# EAGLE design A6SS-3 (EAGLE 6.6.0)

## Sheet 1 of 4: SS-read
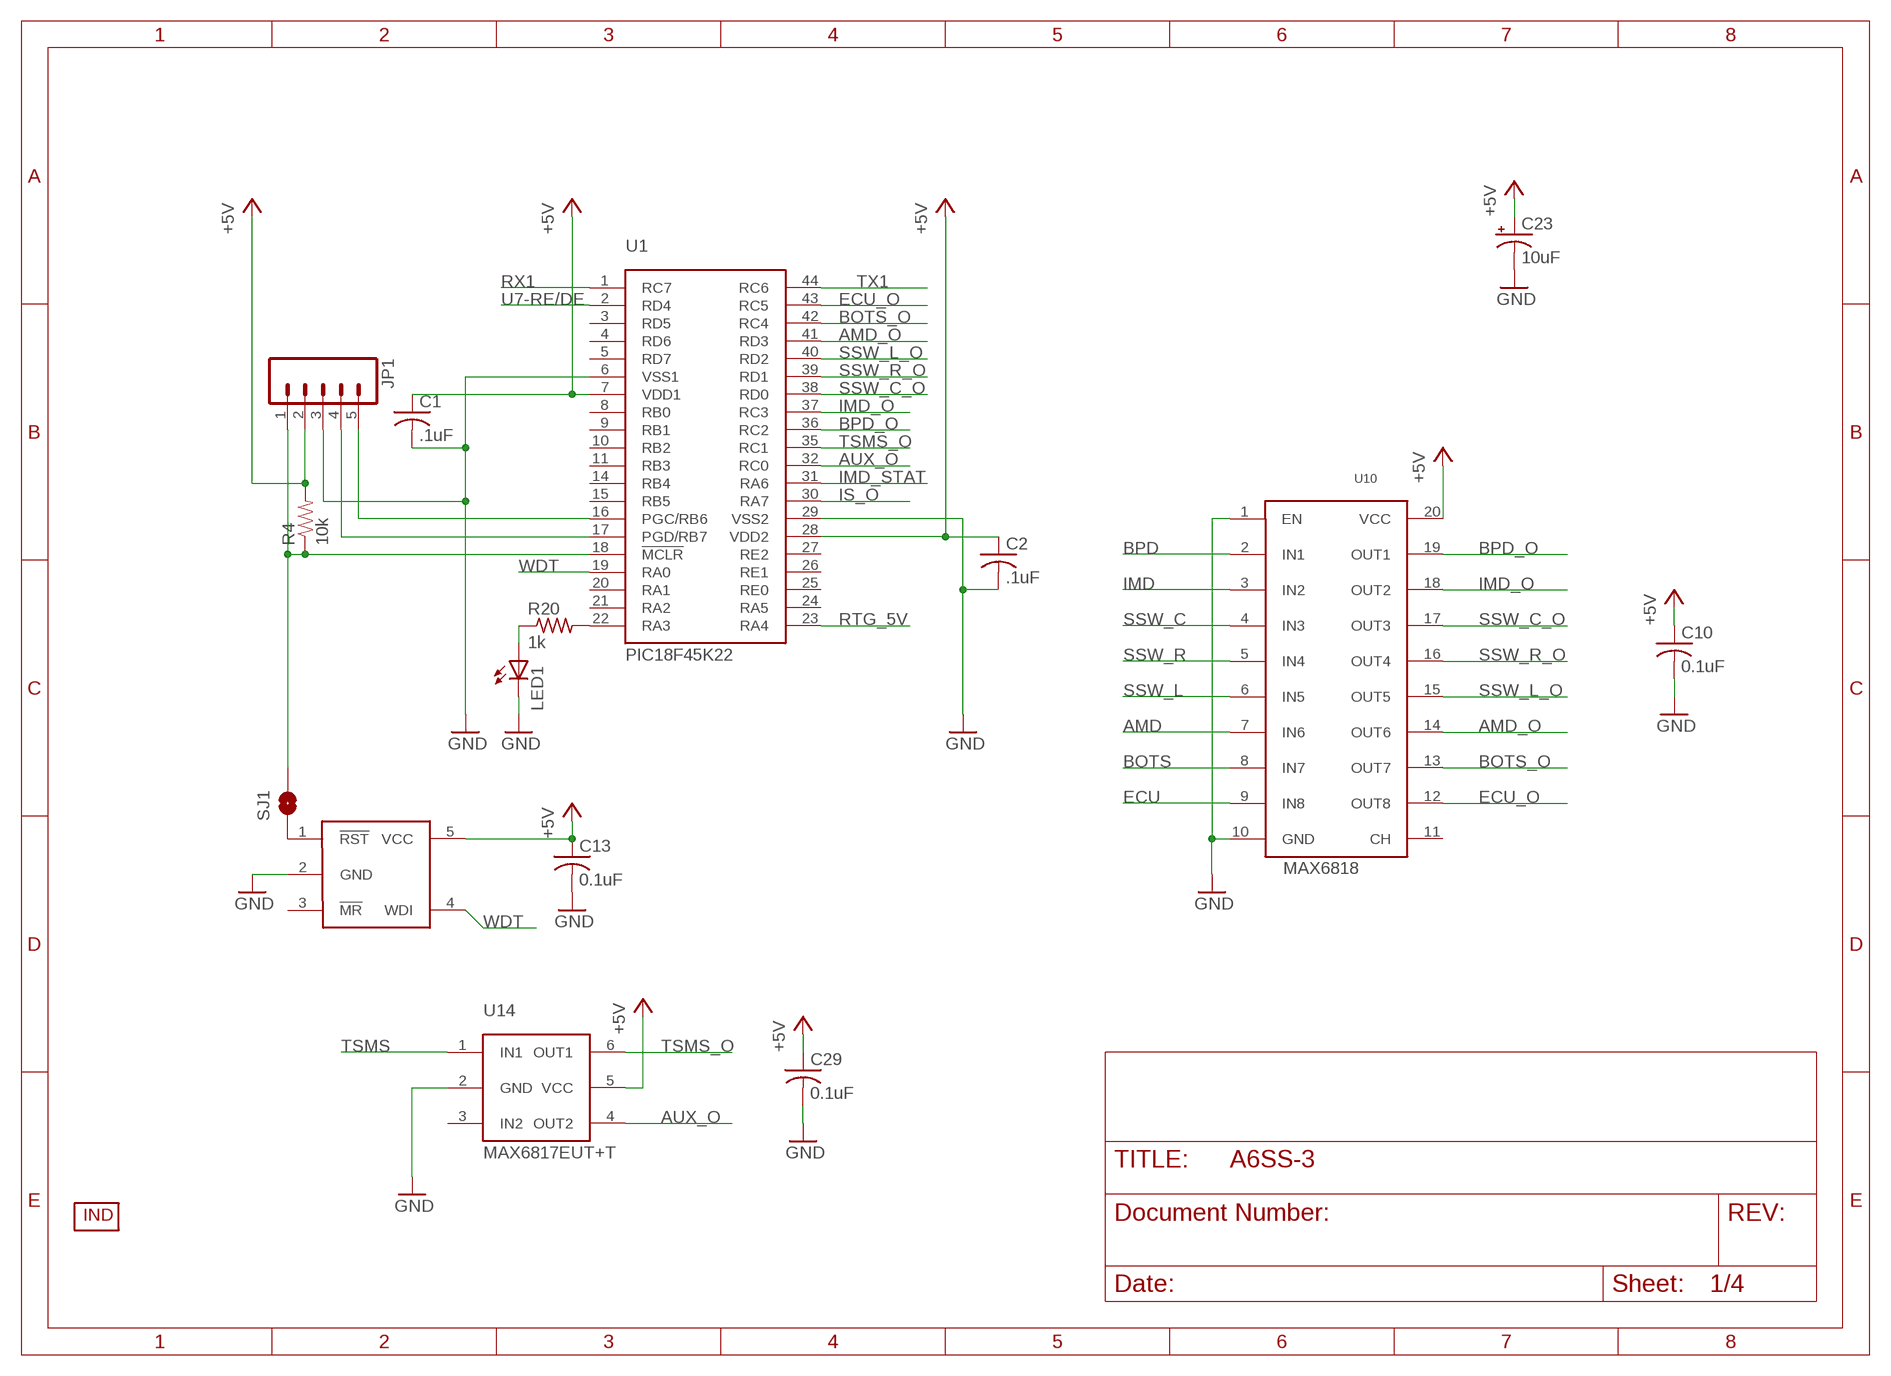
[diagram p0: schematic, sheet 1]

### Parts
C1  .1uF  C-USC0603  [C0603]
C2  .1uF  C-USC0603  [C0603]
C10  0.1uF  C-USC0603  [C0603]
C13  0.1uF  C-USC0603  [C0603]
C23  10uF  10UF-TANT  [EIA3216]
C29  0.1uF  C-USC0603  [C0603]
JP1  M05LOCK_LONGPADS  [1X05_LOCK_LONGPADS]
LED1  LEDCHIPLED_0603  [CHIPLED_0603]
R4  10k  RESISTOR0603-RES  [0603-RES]
R20  1k  R-US_R0603  [R0603]
SJ1  SOLDERJUMPERNO  [SJ_2S-NO]
U1  PIC18F45K22  [TQFP-44]
U10  MAX6818  [SSOP-20]
U14  MAX6817EUT+T  [SOT23-6]
U15  MAX823  [SOT23-5L]
U$1  INDPK1  [PICKIT-PIN-1]

### Nets
+5V: C1.1 C2.1 C10.1 C13.1 C23.A(+) C29.1 JP1.2 R4.2 U1.7(VDD1) U1.28(VDD2) U10.20(VCC) U14.5(VCC) U15.5(VCC) ; also sheet 2,3,4
AMD: U10.7(IN6) ; also sheet 4
AMD_O: U1.41(RD3) U10.14(OUT6)
AUX_O: U1.32(RC0) U14.4(OUT2)
BOTS: U10.8(IN7) ; also sheet 4
BOTS_O: U1.42(RC4) U10.13(OUT7)
BPD: U10.2(IN1) ; also sheet 4
BPD_O: U1.36(RC2) U10.19(OUT1)
ECU: U10.9(IN8) ; also sheet 4
ECU_O: U1.43(RC5) U10.12(OUT8)
GND: C1.2 C2.2 C10.2 C13.2 C23.C(-) C29.2 JP1.3 LED1.C U1.6(VSS1) U1.29(VSS2) U10.1(EN) U10.10(GND) U14.2(GND) U15.2(GND) ; also sheet 2,3,4
IMD: U10.3(IN2) ; also sheet 4
IMD_O: U1.37(RC3) U10.18(OUT2)
IMD_STAT: U1.31(RA6) ; also sheet 3
IS_O: U1.30(RA7) ; also sheet 4
N$1: SJ1.1 U15.1(!RST)
N$16: LED1.A R20.1
N$20: R20.2 U1.22(RA3)
N$40: JP1.4 U1.17(PGD/RB7)
N$43: JP1.5 U1.16(PGC/RB6)
N$46: JP1.1 R4.1 SJ1.2 U1.18(!MCLR)
RTG_5V: U1.23(RA4) ; also sheet 2
RX1: U1.1(RC7) ; also sheet 4
SSW_C: U10.4(IN3) ; also sheet 4
SSW_C_O: U1.38(RD0) U10.17(OUT3)
SSW_L: U10.6(IN5) ; also sheet 4
SSW_L_O: U1.40(RD2) U10.15(OUT5)
SSW_R: U10.5(IN4) ; also sheet 4
SSW_R_O: U1.39(RD1) U10.16(OUT4)
TSMS: U14.1(IN1) ; also sheet 4
TSMS_O: U1.35(RC1) U14.6(OUT1)
TX1: U1.44(RC6) ; also sheet 4
U7-RE/DE: U1.2(RD4) ; also sheet 4
WDT: U1.19(RA0) U15.4(WDI)
Unconnected: U1.3(RD5) U1.4(RD6) U1.5(RD7) U1.8(RB0) U1.9(RB1) U1.10(RB2) U1.11(RB3) U1.14(RB4) U1.15(RB5) U1.20(RA1) U1.21(RA2) U1.24(RA5) U1.25(RE0) U1.26(RE1) U1.27(RE2) U10.11(CH) U14.3(IN2) U15.3(!MR)

## Sheet 2 of 4: PRE charge
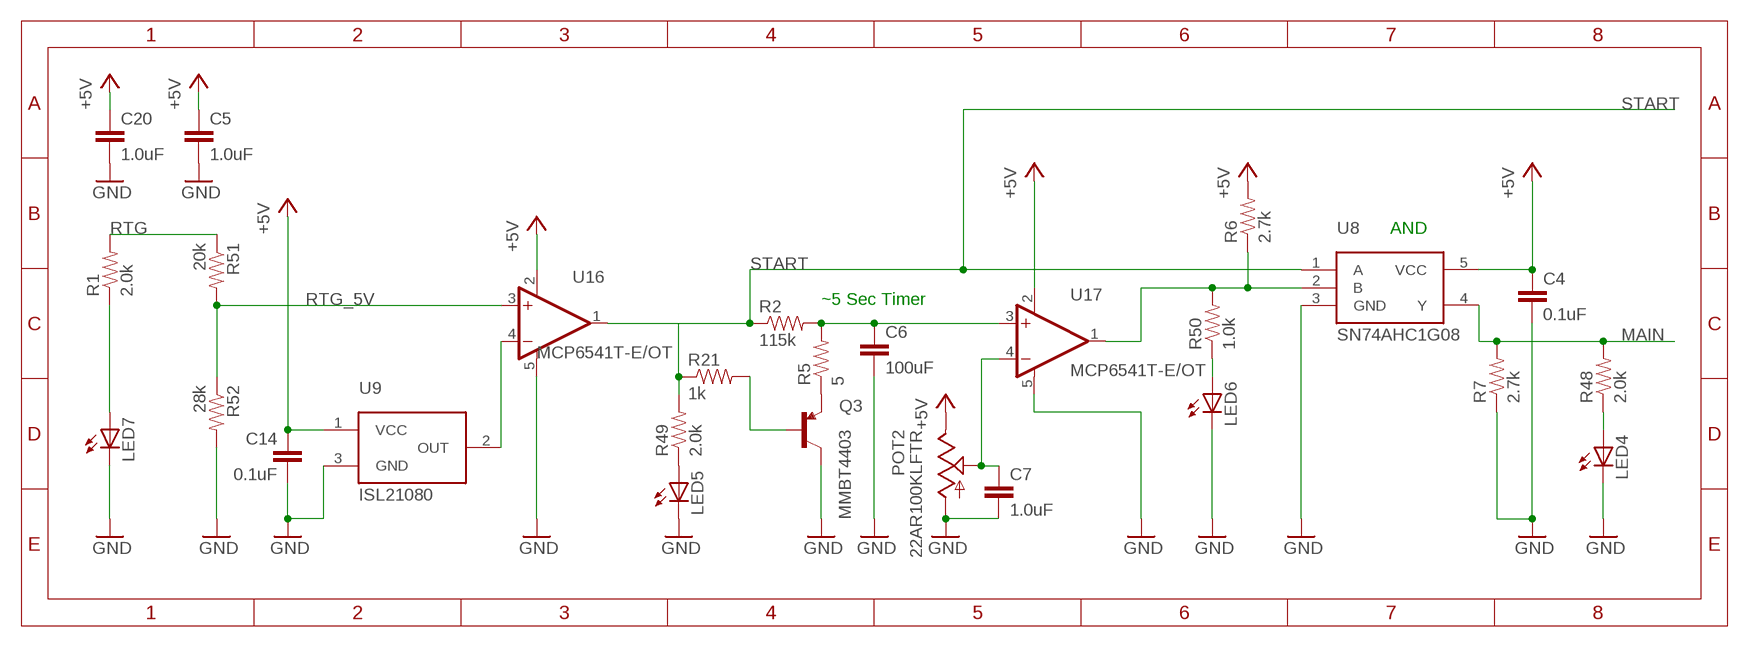
[diagram p1: schematic, sheet 2]

### Parts
C4  0.1uF  CAP0603-CAP  [0603-CAP]
C5  1.0uF  CAP0603-CAP  [0603-CAP]
C6  100uF  CAP1206  [1206]
C7  1.0uF  CAP0805  [0805]
C14  0.1uF  CAP0603-CAP  [0603-CAP]
C20  1.0uF  CAP0805  [0805]
LED4  LEDCHIPLED_0603  [CHIPLED_0603]
LED5  LEDCHIPLED_0603  [CHIPLED_0603]
LED6  LEDCHIPLED_0603  [CHIPLED_0603]
LED7  LEDCHIPLED_0603  [CHIPLED_0603]
POT2  22AR100KLFTR  [22AR100KLFTR]
Q3  MMBT4403  TRANSISTOR_PNPMMBT4403  [SOT23]
R1  2.0k  RESISTOR0603-RES  [0603-RES]
R2  115k  RESISTOR1206  [1206]
R5  5  RESISTOR0603-RES  [0603-RES]
R6  2.7k  RESISTOR0603-RES  [0603-RES]
R7  2.7k  RESISTOR0603-RES  [0603-RES]
R21  1k  RESISTOR0603-RES  [0603-RES]
R48  2.0k  RESISTOR0603-RES  [0603-RES]
R49  2.0k  RESISTOR0603-RES  [0603-RES]
R50  1.0k  RESISTOR0603-RES  [0603-RES]
R51  20k  RESISTOR0603-RES  [0603-RES]
R52  28k  RESISTOR0603-RES  [0603-RES]
U8  SN74AHC1G08  NC7SZ08P5X  [SOT23-5]
U9  ISL21080  [SOT-23]
U16  MCP6541T-E/OT  OPA344  [SOT23-5]
U17  MCP6541T-E/OT  OPA344  [SOT23-5]

### Nets
+5V: C4.1 C5.1 C14.1 C20.1 POT2.1(CCW) R6.2 U8.5(VCC) U9.1(VCC) U16.2(V-) U17.2(V-) ; also sheet 1,3,4
GND: C4.2 C5.2 C6.2 C7.2 C14.2 C20.2 LED4.C LED5.C LED6.C LED7.C POT2.3(CW) Q3.3(C) R7.1 R52.2 U8.3(GND) U9.3(GND) U16.5(V+) U17.5(V+) ; also sheet 1,3,4
MAIN: R7.2 R48.2 U8.4(Y) ; also sheet 4
N$3: C7.1 POT2.2(W) U17.4(-IN)
N$5: Q3.1(B) R21.2
N$6: Q3.2(E) R5.1
N$11: U9.2(OUT) U16.4(-IN)
N$33: LED7.A R1.1
N$59: C6.1 R2.2 R5.2 U17.3(+IN)
N$62: R6.1 R50.2 U8.2(B) U17.1(OUT)
N$63: LED4.A R48.1
N$65: LED5.A R49.1
N$67: LED6.A R50.1
RTG: R1.2 R51.1 ; also sheet 4
RTG_5V: R51.2 R52.1 U16.3(+IN) ; also sheet 1
START: R2.1 R21.1 R49.2 U8.1(A) U16.1(OUT) ; also sheet 4

### Notes on the sheet
- AND
- ~5 Sec Timer

## Sheet 3 of 4
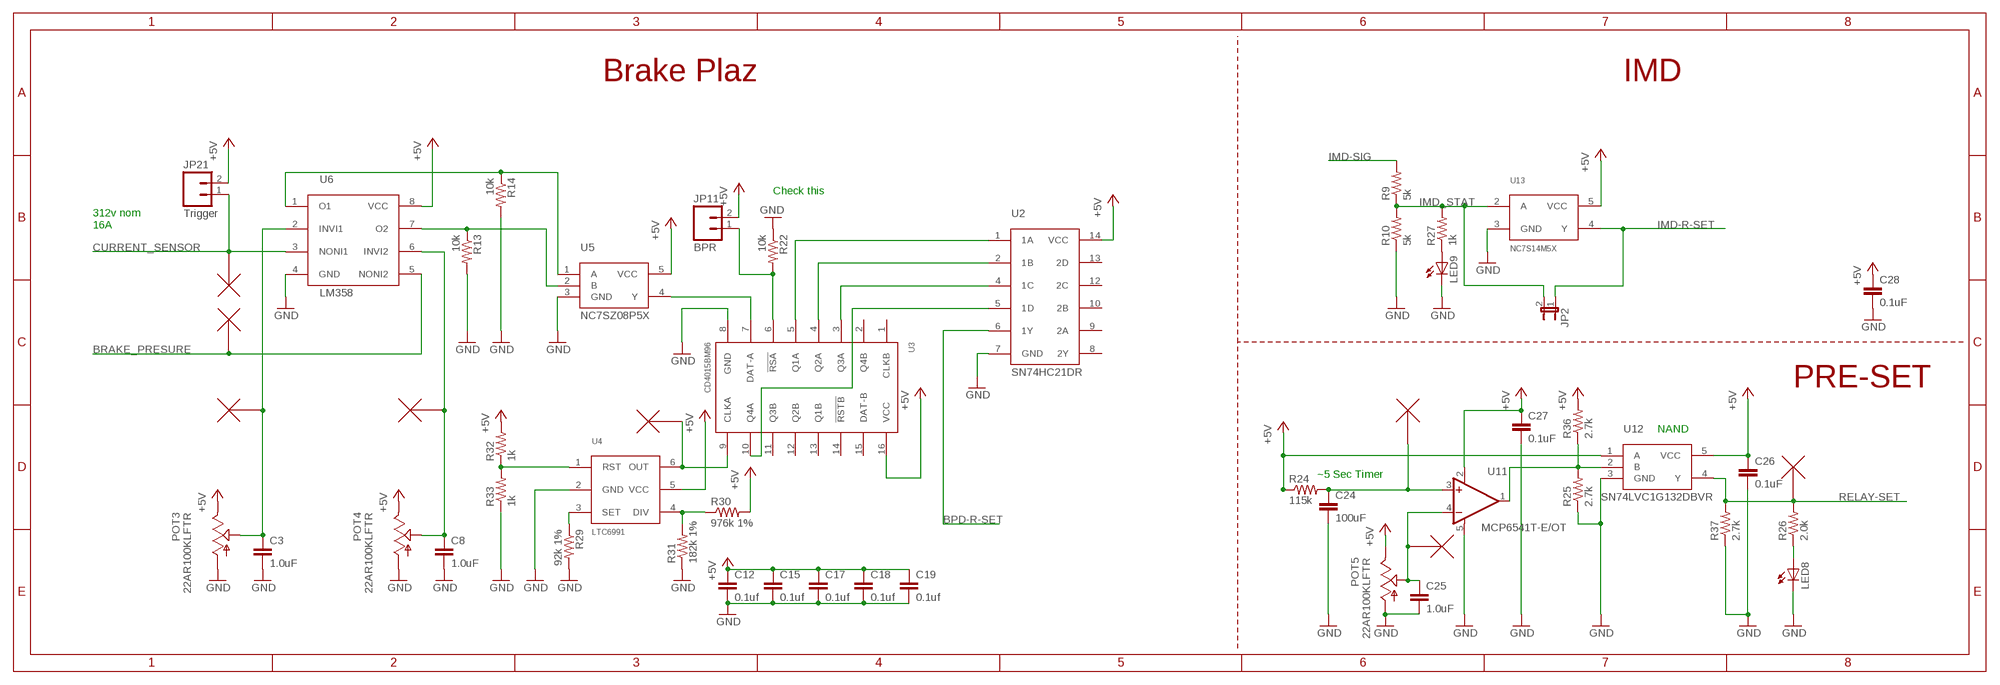
[diagram p2: schematic, sheet 3]

### Parts
BPR  TESTPOINT  [R0603]
C3  1.0uF  1.0UF-25V-+80/-20(0805)  [0805]
C8  1.0uF  1.0UF-25V-+80/-20(0805)  [0805]
C12  0.1uf  CAP0603-CAP  [0603-CAP]
C15  0.1uf  CAP0603-CAP  [0603-CAP]
C17  0.1uf  CAP0603-CAP  [0603-CAP]
C18  0.1uf  CAP0603-CAP  [0603-CAP]
C19  0.1uf  CAP0805  [0805]
C24  100uF  CAP1206  [1206]
C25  1.0uF  CAP0805  [0805]
C26  0.1uF  CAP0603-CAP  [0603-CAP]
C27  0.1uF  CAP0603-CAP  [0603-CAP]
C28  0.1uF  CAP0805  [0805]
CLK  TESTPOINT  [R0603]
CS  TESTPOINT  [R0603]
CST  TESTPOINT  [R0603]
JP2  JUMPER-2SMD-NO  [SJ_2S-NO]
JP11  BPR  M02POLAR_LOCK  [MOLEX-1X2_LOCK]
JP21  Trigger  M02POLAR_LOCK  [MOLEX-1X2_LOCK]
LED8  LEDCHIPLED_0603  [CHIPLED_0603]
LED9  LEDCHIPLED_0603  [CHIPLED_0603]
PCG  TESTPOINT  [R0603]
POT3  22AR100KLFTR  [22AR100KLFTR]
POT4  22AR100KLFTR  [22AR100KLFTR]
POT5  22AR100KLFTR  [22AR100KLFTR]
R9  5k  RESISTOR0603-RES  [0603-RES]
R10  5k  RESISTOR0603-RES  [0603-RES]
R13  10k  RESISTOR0603-RES  [0603-RES]
R14  10k  RESISTOR0603-RES  [0603-RES]
R22  10k  RESISTOR0603-RES  [0603-RES]
R24  115k  RESISTOR1206  [1206]
R25  2.7k  RESISTOR0603-RES  [0603-RES]
R26  2.0k  RESISTOR0603-RES  [0603-RES]
R27  1k  RESISTOR0603-RES  [0603-RES]
R29  92k 1%  RESISTOR0603-RES  [0603-RES]
R30  976k 1%  RESISTOR0603-RES  [0603-RES]
R31  182k 1%  RESISTOR0603-RES  [0603-RES]
R32  1k  RESISTOR0603-RES  [0603-RES]
R33  1k  RESISTOR0603-RES  [0603-RES]
R36  2.7k  RESISTOR0603-RES  [0603-RES]
R37  2.7k  RESISTOR0603-RES  [0603-RES]
RST  TESTPOINT  [R0603]
U2  SN74HC21DR  SN74HC20DR  [SO14]
U3  CD4015BM96  [SO-16]
U4  LTC6991  [TSOT-23-6]
U5  NC7SZ08P5X  [SOT23-5]
U6  LM358  [TSSOP-8]
U11  MCP6541T-E/OT  OPA344  [SOT23-5]
U12  SN74LVC1G132DBVR  NC7SZ08P5X  [SOT23-5]
U13  NC7S14M5X  [SOT23-5]
U$2  TESTPOINT  [R0603]
U$3  TESTPOINT  [R0603]

### Nets
+5V: C12.1 C15.1 C17.1 C18.1 C19.1 C26.1 C27.1 C28.1 JP11.2 JP21.2 POT3.1(CCW) POT4.1(CCW) POT5.1(CCW) R24.1 R30.2 R32.2 R36.2 U2.14(VCC) U3.16(VCC) U4.5(VCC) U5.5(VCC) U6.8(VCC) U11.2(V-) U12.1(A) U12.5(VCC) U13.5(VCC) ; also sheet 1,2,4
BPD-R-SET: U2.6(1Y) ; also sheet 4
BRAKE_PRESURE: BPR.1 BPR.2 U6.5(NONI2) ; also sheet 4
CURRENT_SENSOR: CS.1 CS.2 JP21.1 U6.3(NONI1) ; also sheet 4
GND: C3.2 C8.2 C12.2 C15.2 C17.2 C18.2 C19.2 C24.2 C25.2 C26.2 C27.2 C28.2 LED8.C LED9.C POT3.3(CW) POT4.3(CW) POT5.3(CW) R10.1 R13.2 R14.2 R22.1 R25.1 R29.2 R31.1 R33.1 R37.1 U2.7(GND) U3.8(GND) U4.2(GND) U5.3(GND) U6.4(GND) U11.5(V+) U12.3(GND) U13.3(GND) ; also sheet 1,2,4
IMD-R-SET: JP2.1 U13.4(Y) ; also sheet 4
IMD-SIG: R9.2 ; also sheet 4
IMD_STAT: JP2.2 R9.1 R10.2 R27.2 U13.2(A) ; also sheet 1
N$4: C25.1 POT5.2(W) RST.1 RST.2 U11.4(-IN)
N$7: U2.5(1D) U3.10(Q4A)
N$10: R30.1 R31.2 U4.4(DIV)
N$13: U3.7(DAT-A) U5.4(Y)
N$14: JP11.1 R22.2 U3.6(!RSA)
N$15: C24.1 R24.2 U11.3(+IN) U$2.1 U$2.2
N$17: U2.1(1A) U3.5(Q1A)
N$18: U2.2(1B) U3.4(Q2A)
N$19: U2.4(1C) U3.3(Q3A)
N$21: R29.1 U4.3(SET)
N$22: CLK.1 CLK.2 U3.9(CLKA) U4.6(OUT)
N$23: C8.1 PCG.1 PCG.2 POT4.2(W) U6.6(INVI2)
N$24: R25.2 R36.1 U11.1(OUT) U12.2(B)
N$25: R32.1 R33.2 U4.1(RST)
N$26: C3.1 CST.1 CST.2 POT3.2(W) U6.2(INVI1)
N$28: R14.1 U5.1(A) U6.1(O1)
N$29: LED8.A R26.1
N$30: R13.1 U5.2(B) U6.7(O2)
N$32: LED9.A R27.1
RELAY-SET: R26.2 R37.2 U12.4(Y) U$3.1 U$3.2 ; also sheet 4
Unconnected: U2.8(2Y) U2.9(2A) U2.10(2B) U2.12(2C) U2.13(2D) U3.1(CLKB) U3.2(Q4B) U3.11(Q3B) U3.12(Q2B) U3.13(Q1B) U3.14(!RSTB) U3.15(DAT-B)

### Notes on the sheet
- Brake Plaz | IMD
- Check this
- 312v nom
  16A
- PRE-SET
- NAND
- ~5 Sec Timer

## Sheet 4 of 4
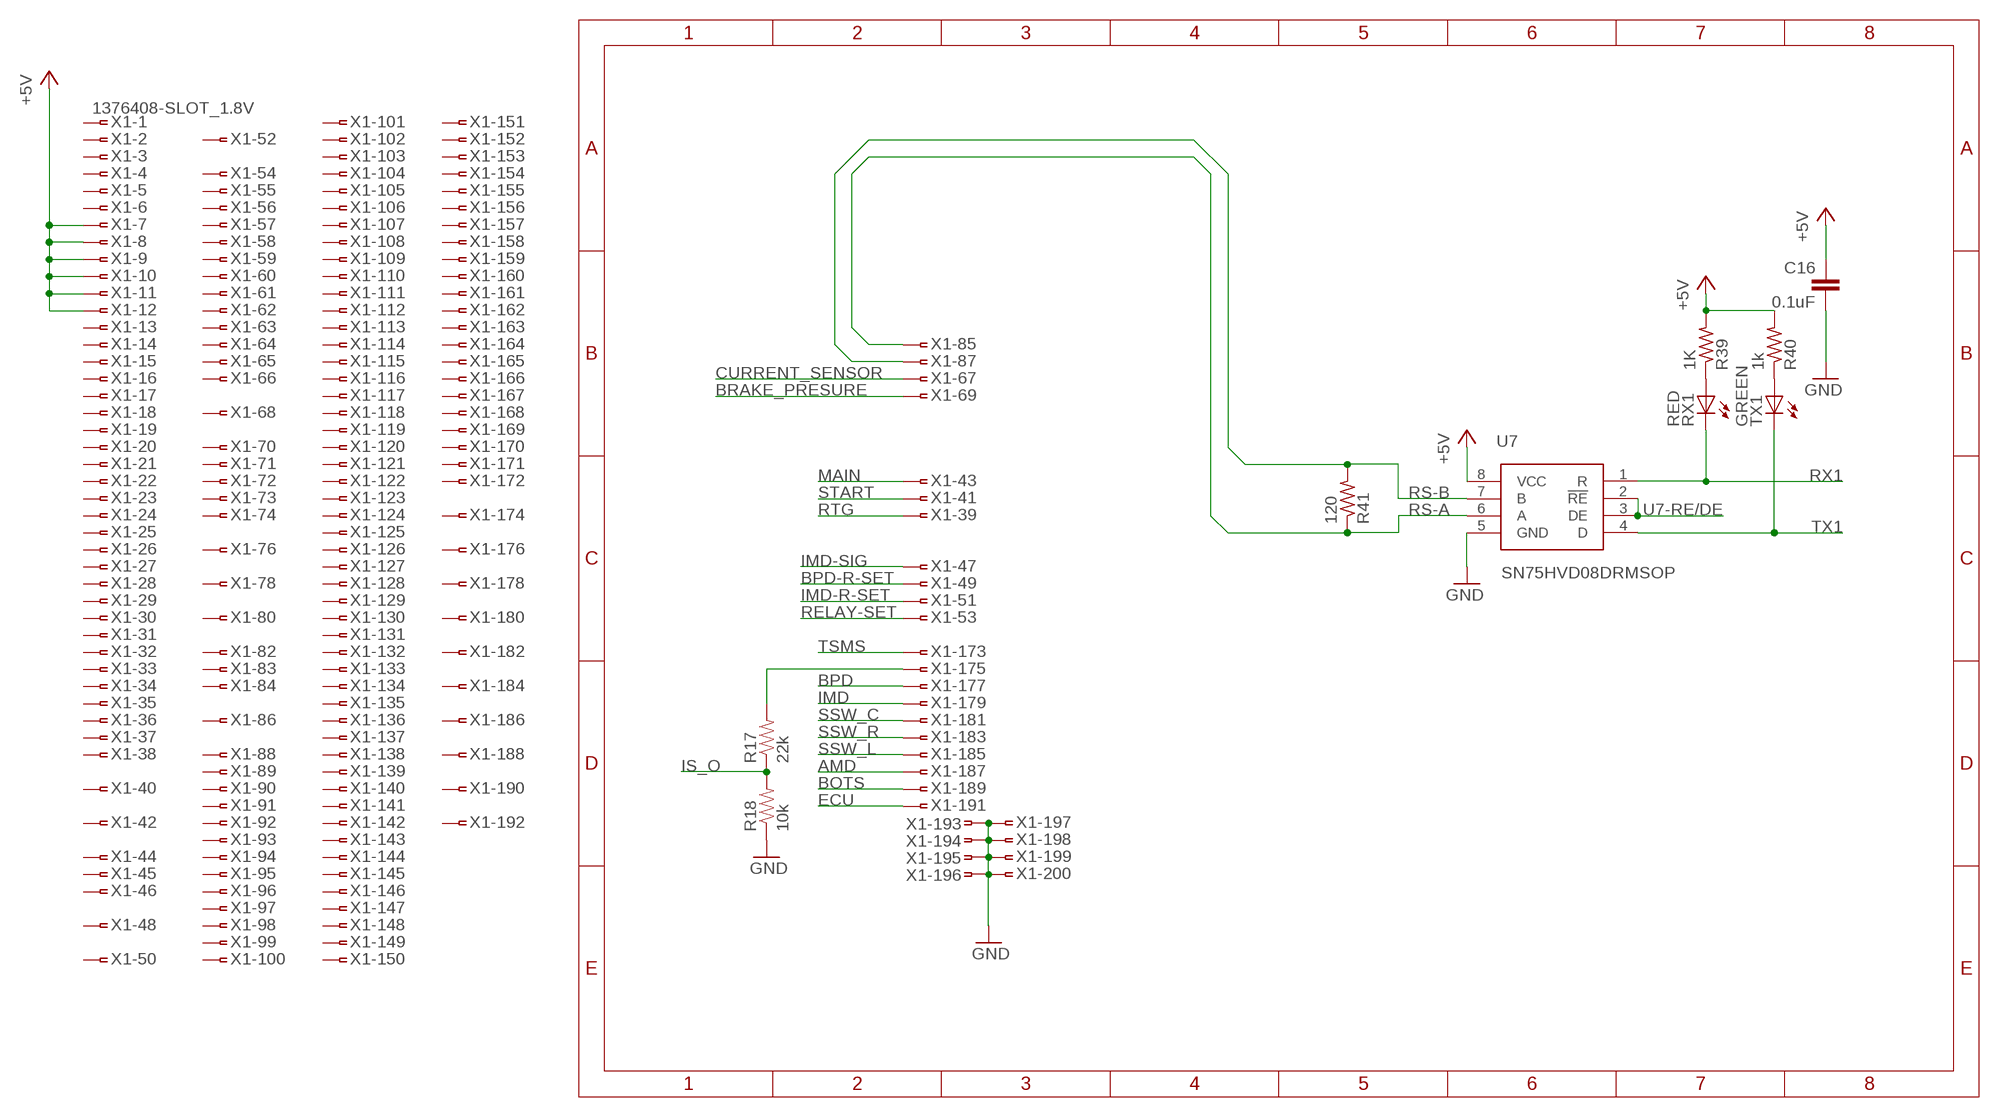
[diagram p3: schematic, sheet 4]

### Parts
C16  0.1uF  CAP0603-CAP  [0603-CAP]
R17  22k  RESISTOR0805-RES  [0805]
R18  10k  RESISTOR0805-RES  [0805]
R39  1K  R-US_R0603  [R0603]
R40  1k  R-US_R0603  [R0603]
R41  120  R-US_R0603  [R0603]
RX1  RED  LEDCHIPLED_0603  [CHIPLED_0603]
TX1  GREEN  LEDCHIPLED_0603  [CHIPLED_0603]
U7  SN75HVD08DRMSOP  [MSOP-8]
X1  1376408-SLOT_1.8V  [SLOT-1376408-1_1.8V]

### Nets
+5V: C16.1 R39.2 R40.2 U7.8(VCC) X1.7 X1.8 X1.9 X1.10 X1.11 X1.12 ; also sheet 1,2,3
AMD: X1.187 ; also sheet 1
BOTS: X1.189 ; also sheet 1
BPD: X1.177 ; also sheet 1
BPD-R-SET: X1.49 ; also sheet 3
BRAKE_PRESURE: X1.69 ; also sheet 3
CURRENT_SENSOR: X1.67 ; also sheet 3
ECU: X1.191 ; also sheet 1
GND: C16.2 R18.1 U7.5(GND) X1.193 X1.194 X1.195 X1.196 X1.197 X1.198 X1.199 X1.200 ; also sheet 1,2,3
IMD: X1.179 ; also sheet 1
IMD-R-SET: X1.51 ; also sheet 3
IMD-SIG: X1.47 ; also sheet 3
IS_O: R17.1 R18.2 ; also sheet 1
MAIN: X1.43 ; also sheet 2
N$2: R17.2 X1.175
N$39: R40.1 TX1.A
N$41: R39.1 RX1.A
RELAY-SET: X1.53 ; also sheet 3
RS-A: R41.1 U7.6(A) X1.85
RS-B: R41.2 U7.7(B) X1.87
RTG: X1.39 ; also sheet 2
RX1: RX1.C U7.1(R) ; also sheet 1
SSW_C: X1.181 ; also sheet 1
SSW_L: X1.185 ; also sheet 1
SSW_R: X1.183 ; also sheet 1
START: X1.41 ; also sheet 2
TSMS: X1.173 ; also sheet 1
TX1: TX1.C U7.4(D) ; also sheet 1
U7-RE/DE: U7.2(!RE) U7.3(DE) ; also sheet 1
Unconnected: X1.1 X1.2 X1.3 X1.4 X1.5 X1.6 X1.13 X1.14 X1.15 X1.16 X1.17 X1.18 X1.19 X1.20 X1.21 X1.22 X1.23 X1.24 X1.25 X1.26 X1.27 X1.28 X1.29 X1.30 X1.31 X1.32 X1.33 X1.34 X1.35 X1.36 X1.37 X1.38 X1.40 X1.42 X1.44 X1.45 X1.46 X1.48 X1.50 X1.52 X1.54 X1.55 X1.56 X1.57 X1.58 X1.59 X1.60 X1.61 X1.62 X1.63 X1.64 X1.65 X1.66 X1.68 X1.70 X1.71 X1.72 X1.73 X1.74 X1.75 X1.76 X1.77 X1.78 X1.79 X1.80 X1.81 X1.82 X1.83 X1.84 X1.86 X1.88 X1.89 X1.90 X1.91 X1.92 X1.93 X1.94 X1.95 X1.96 X1.97 X1.98 X1.99 X1.100 X1.101 X1.102 X1.103 X1.104 X1.105 X1.106 X1.107 X1.108 X1.109 X1.110 X1.111 X1.112 X1.113 X1.114 X1.115 X1.116 X1.117 X1.118 X1.119 X1.120 X1.121 X1.122 X1.123 X1.124 X1.125 X1.126 X1.127 X1.128 X1.129 X1.130 X1.131 X1.132 X1.133 X1.134 X1.135 X1.136 X1.137 X1.138 X1.139 X1.140 X1.141 X1.142 X1.143 X1.144 X1.145 X1.146 X1.147 X1.148 X1.149 X1.150 X1.151 X1.152 X1.153 X1.154 X1.155 X1.156 X1.157 X1.158 X1.159 X1.160 X1.161 X1.162 X1.163 X1.164 X1.165 X1.166 X1.167 X1.168 X1.169 X1.170 X1.171 X1.172 X1.174 X1.176 X1.178 X1.180 X1.182 X1.184 X1.186 X1.188 X1.190 X1.192

## Library data of the parts
BPR CLK CS CST PCG RST U$2 U$3 = DFT2:TESTPOINT
C1 C2 C10 C13 C29 = adafruit:C-US: CAPACITOR, American symbol
C3 C8 = SparkFun-Capacitors:1.0UF-25V-+80/-20(0805); PROD_ID: CAP-11625
C4 C5 C7 C12 C14-C20 C25-C28 = SparkFun-Passives:CAP: Capacitor Standard 0603 ceramic capacitor, and 0.1" leaded capacitor.
C6 C24 = SparkFun-Capacitors:CAP: Capacitor Standard 0603 ceramic capacitor, and 0.1" leaded capacitor.
C23 = SparkFun-Capacitors:10UF-TANT: 10uF Tantalum SMT CAP-00811- 16V 10% (EIA-3216); PROD_ID: CAP-00811
JP1 = SparkFun-Connectors:M05: Header 5 Standard 5-pin 0.1" header. Use with straight break away headers (SKU : PRT-00116), right angle break away headers (PRT-00553), swiss pins (PRT-00743), machine pins (PRT-00117), and female headers (PRT-00115). Molex polarized connector foot print use with SKU : PRT-08230 with associated crimp pins and housings.
JP2 = SparkFun-Passives:JUMPER-2: Jumper Basic 0.1" spaced jumper. Use with breakaway headers.
JP11 JP21 = SparkFun-Connectors:M02: Standard 2-pin 0.1" header. Use with - straight break away headers ( PRT-00116) - right angle break away headers (PRT-00553) - swiss pins (PRT-00743) - machine pins (PRT-00117) - female headers (PRT-00115) Molex polarized connector foot print use with: PRT-08233 with associated crimp pins and housings. 2.54_SCREWTERM for use with PRT-10571. 3.5mm Screw Terminal footprints for PRT-08084 5mm Screw Terminal footprints for use with PRT-08433
LED1 LED4-LED9 RX1 TX1 = adafruit:LED: LED OSRAM: - CHIPLED LG R971, LG N971, LY N971, LG Q971, LY Q971, LO R971, LY R971 LH N974, LH R974 LS Q976, LO Q976, LY Q976 LO Q996 - Hyper CHIPLED LW Q18S LB Q993, LB Q99A, LB R99A - SideLED LS A670, LO A670, LY A670, LG A670, LP A670 LB A673, LV A673, LT A673, LW A673 LH A674 LY A675 LS A676, LA A676, LO A676, LY A676, LW A676 LS A679, LY A679, LG A679 - Hyper Micro SIDELED® LS Y876, LA Y876, LO Y876, LY Y876 LT Y87S - SmartLED LW L88C, LW L88S LB L89C, LB L89S, LG L890 LS L89K, LO L89K, LY L89K LS L896, LA L896, LO L896, LY L896 - TOPLED LS T670, LO T670, LY T670, LG T670, LP T670 LSG T670, LSP T670, LSY T670, LOP T670, LYG T670 LG T671, LOG T671, LSG T671 LB T673, LV T673, LT T673, LW T673 LH T674 LS T676, LA T676, LO T676, LY T676, LB T676, LH T676, LSB T676, LW T676 LB T67C, LV T67C, LT T67C, LS T67K, LO T67K, LY T67K, LW E67C LS E67B, LA E67B, LO E67B, LY E67B, LB E67C, LV E67C, LT E67C LW T67C LS T679, LY T679, LG T679 LS T770, LO T770, LY T770, LG T770, LP T770 LB T773, LV T773, LT T773, LW T773 LH T774 LS E675, LA E675, LY E675, LS T675 LS T776, LA T776, LO T776, LY T776, LB T776 LHGB T686 LT T68C, LB T68C - Hyper Mini TOPLED® LB M676 - Mini TOPLED Santana® LG M470 LS M47K, LO M47K, LY M47K Source: http://www.osram.convergy.de/
POT2-POT5 = FSAE Eletric:22AR100KLFTR; PARTNO: 22AR100KLFTR
Q3 = SparkFun-DiscreteSemi:TRANSISTOR_PNP: Generic PNP BJT Double check pinouts against datasheets- not all devices are the same! MMBT3906 - 40V 200mA SOT-23 (TRANS-08052) MMBT4403 - 40V 600mA SOT-23 (TRANS-09245); PROD_ID: TRANS-09245
R1 R4-R7 R9 R10 R17 R18 R21 R25-R27 R36 R37 R48-R50 = SparkFun-Passives:RESISTOR: Resistor Basic schematic elements and footprints for 0603, 1206, and PTH resistors.
R2 R13 R14 R22 R24 R29-R33 R51 R52 = SparkFun-Resistors:RESISTOR: Resistor Basic schematic elements and footprints for 0603, 1206, and PTH resistors.
R20 R39-R41 = adafruit:R-US_: RESISTOR, American symbol
SJ1 = SparkFun-Passives:SOLDERJUMPER: Solder Jumper Standard SMD solder jumper. Used to automate production. Two varients : Normally Open and Normally Closed are the same, but have different paste layers. NC will have a large amount of paste and should jumper during reflow.
U1 = FSAE Eletric:PIC18F45K22
U2 = NASA_LIB:SN74HC20DR
U3 = FSAE Eletric:CD4015BM96
U4 = FSAE Eletric:LTC6991
U5 U8 U12 = FSAE Eletric:NC7SZ08P5X
U6 = NASA_LIB:LM358
U7 = FSAE Eletric:SN75HVD08DR
U9 = DFT2:ISL21080
U10 = NASA_LIB:MAX6818
U11 U16 U17 = SparkFun-AnalogIC:OPA344: Single gate rail-to-rail output op-amp. Inputs extend 300mV past rails.
U13 = FSAE Eletric:NC7S14M5X
U14 = NASA_LIB:MAX6817EUT+T
U15 = NASA_LIB:MAX823
U$1 = FSAE Eletric (2):IND
X1 = con-amp:1376408: DDR1 & DDR2 SODIMM SOCKET 0.6mm Pitch 200 Pos. Standard Profile, Standard Type (used on Kontron X-Board) Source: http://catalog.tycoelectronics.com .. JPN_CD_1376408_S.pdf

## Board
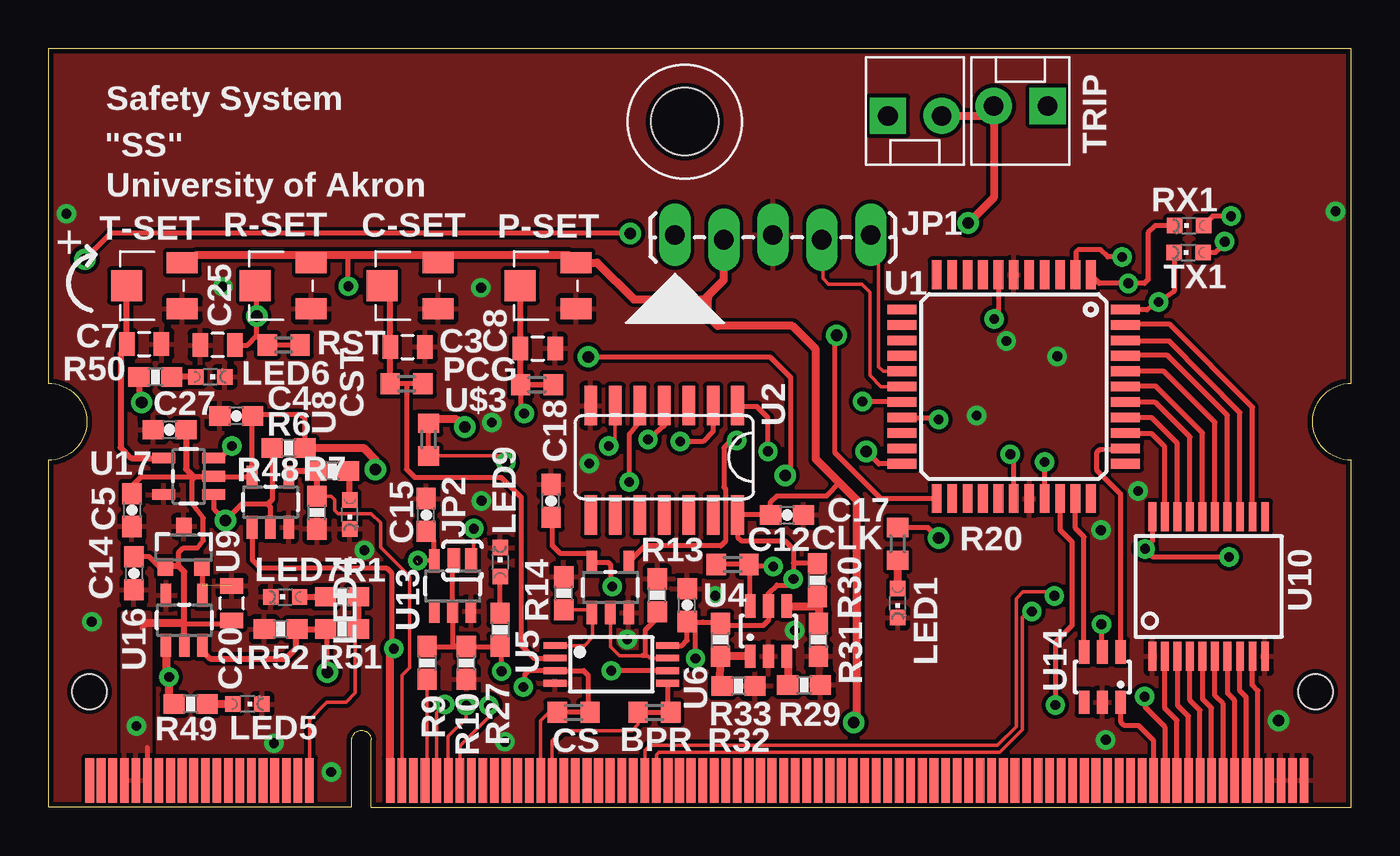
[diagram p4: board, top side]
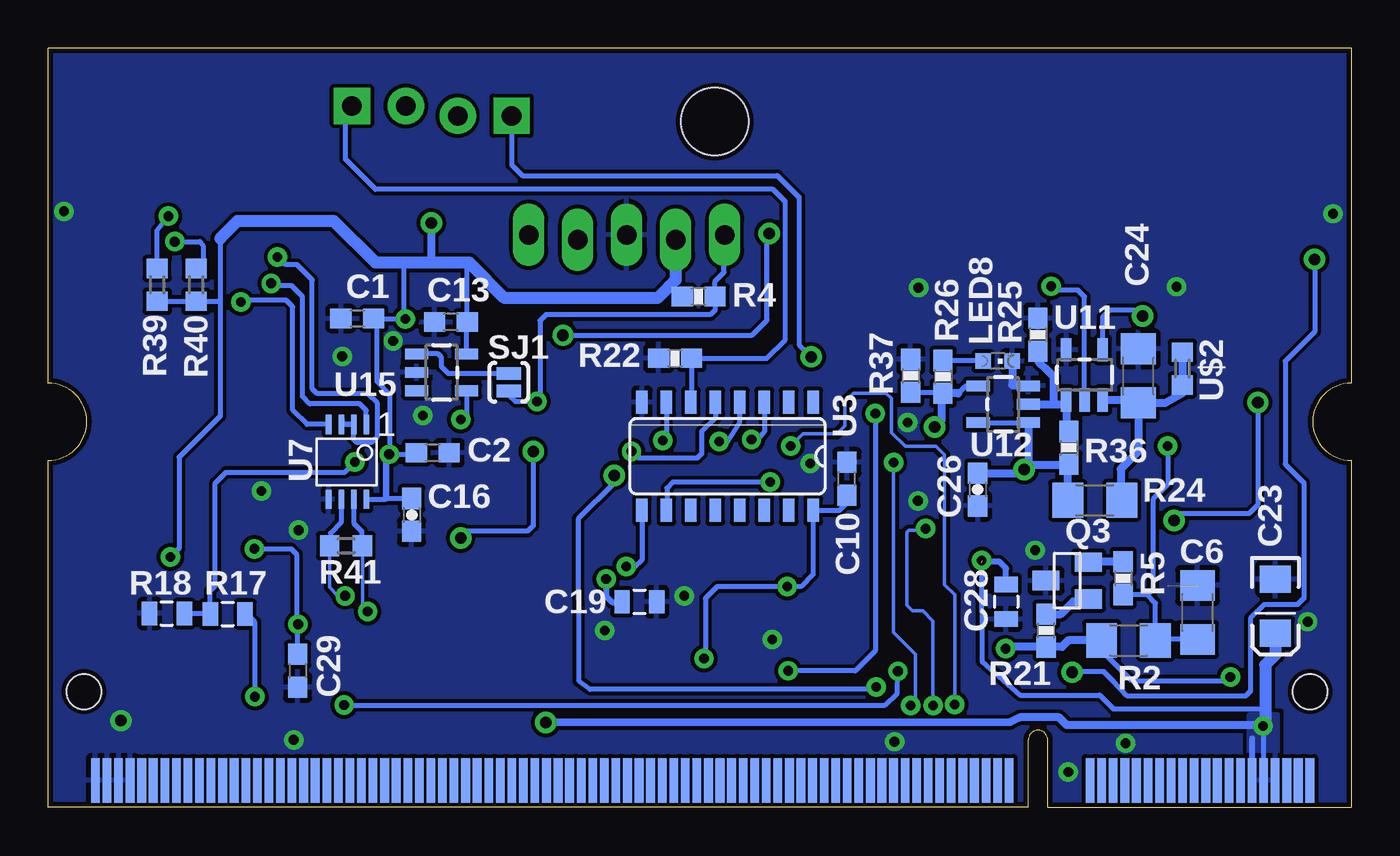
[diagram p5: board, bottom side, seen from below]

Size 67.6 x 39.37 mm. Coordinates in mm from the lower left corner, seen from the top.
Copper layers (1*16): Top 0.035mm / dielectric 1.5mm / Bottom 0.035mm
Design rules "SparkFun": minimum track width 8mil, minimum drill 20mil, track to track 8mil, track to pad 8mil, pad to pad 8mil, via to via 8mil, smd to smd 8mil, copper to edge 10mil, drill to drill 8mil, minimum pad ring 12mil, minimum via ring 10mil, stop-mask expansion 4mil, vias tented up to drill 25mil, thermal gap 10mil

### Footprints (pad centres in the part's own frame; a part is rotated, then mirrored left to right if it is on the bottom)
R0603 = smd 1 x 1.1: 1 -0.85,0; 2 0.85,0
C0603 = smd 1.1 x 1: 1 -0.85,0; 2 0.85,0
0805 = smd 0.8 x 1.2: 1 -0.9,0; 2 0.9,0
0603-CAP = smd 1.1 x 1: 1 -0.85,0; 2 0.85,0
1206 = smd 1.6 x 1.8: 1 -1.4,0; 2 1.4,0
EIA3216 = smd 1.4 x 1.6: A 1.4,0; C -1.4,0
1X05_LOCK_LONGPADS = drill 1.016 long: 1 0,0; 2 2.54,-0.254; 3 5.08,0; 4 7.62,-0.254; 5 10.16,0
SJ_2S-NO = smd 0.635 x 1.27: 1 -0.45,0; 2 0.45,0
MOLEX-1X2_LOCK = drill 1.016 pad 1.88 square: 1 -0.127,0 | drill 1.016 pad 1.88: 2 2.667,0
CHIPLED_0603 = smd 0.8 x 0.8: A 0,-0.75; C 0,0.75
22AR100KLFTR = smd 1.092 x 1.6: 1 1.194,-1.448; 3 -1.194,-1.448 | smd 1.6 x 1.6: 2 0,1.448
SOT23 = smd 1 x 1.4: 1 -0.95,-1.1; 2 0.95,-1.1; 3 0,1.1
0603-RES = smd 1.1 x 1: 1 -0.85,0; 2 0.85,0
TQFP-44 = smd 1.5 x 0.5: 1 -5.8,4; 2 -5.8,3.2; 3 -5.8,2.4; 4 -5.8,1.6; 5 -5.8,0.8; 6 -5.8,0; 7 -5.8,-0.8; 8 -5.8,-1.6; 9 -5.8,-2.4; 10 -5.8,-3.2; 11 -5.8,-4; 23 5.8,-4; 24 5.8,-3.2; 25 5.8,-2.4; 26 5.8,-1.6; 27 5.8,-0.8; 28 5.8,0; 29 5.8,0.8; 30 5.8,1.6; 31 5.8,2.4; 32 5.8,3.2; 33 5.8,4 | smd 0.5 x 1.5: 12 -4,-5.8; 13 -3.2,-5.8; 14 -2.4,-5.8; 15 -1.6,-5.8; 16 -0.8,-5.8; 17 0,-5.8; 18 0.8,-5.8; 19 1.6,-5.8; 20 2.4,-5.8; 21 3.2,-5.8; 22 4,-5.8; 34 4,5.8; 35 3.2,5.8; 36 2.4,5.8; 37 1.6,5.8; 38 0.8,5.8; 39 0,5.8; 40 -0.8,5.8; 41 -1.6,5.8; 42 -2.4,5.8; 43 -3.2,5.8; 44 -4,5.8
SO14 = smd 0.66 x 2.032: 1 -3.175,-2.68; 2 -1.905,-2.68; 3 -0.635,-2.68; 4 0.635,-2.68; 5 1.905,-2.68; 6 3.175,-2.68; 7 4.445,-2.68; 8 4.445,2.997; 9 3.175,2.997; 10 1.905,2.997; 11 0.635,2.997; 12 -0.635,2.997; 13 -1.905,2.997; 14 -3.175,2.997
SO-16 = smd 0.6 x 1.2: 1 -4.445,-2.8; 2 -3.175,-2.8; 3 -1.905,-2.8; 4 -0.635,-2.8; 5 0.635,-2.8; 6 1.905,-2.8; 7 3.175,-2.8; 8 4.445,-2.8; 9 4.445,2.8; 10 3.175,2.8; 11 1.905,2.8; 12 0.635,2.8; 13 -0.635,2.8; 14 -1.905,2.8; 15 -3.175,2.8; 16 -4.445,2.8
TSOT-23-6 = smd 1.2 x 0.55: 1 -1.3,0.95; 2 -1.3,0; 3 -1.3,-0.95; 4 1.3,-0.95; 5 1.3,0; 6 1.3,0.95
SOT23-5 = smd 0.55 x 1.2: 1 -0.95,-1.3; 2 0,-1.3; 3 0.95,-1.3; 4 0.95,1.3; 5 -0.95,1.3
TSSOP-8 = smd 1.2 x 0.35: 1 -2.925,0.975; 2 -2.925,0.325; 3 -2.925,-0.325; 4 -2.925,-0.975; 5 2.925,-0.975; 6 2.925,-0.325; 7 2.925,0.325; 8 2.925,0.975
MSOP-8 = smd 0.3 x 1: 1 -0.975,-1.95; 2 -0.325,-1.95; 3 0.325,-1.95; 4 0.975,-1.95; 5 0.975,1.925; 6 0.325,1.925; 7 -0.325,1.925; 8 -0.975,1.925
SOT-23 = smd 0.8 x 0.9: 1 -0.95,-0.23; 2 0.95,-0.23; 3 0,1.87
SSOP-20 = smd 0.4 x 1.5: 1 -2.925,-3.625; 2 -2.275,-3.625; 3 -1.625,-3.625; 4 -0.975,-3.625; 5 -0.325,-3.625; 6 0.325,-3.625; 7 0.975,-3.625; 8 1.625,-3.625; 9 2.275,-3.625; 10 2.925,-3.625; 11 2.925,3.625; 12 2.275,3.625; 13 1.625,3.625; 14 0.975,3.625; 15 0.325,3.625; 16 -0.325,3.625; 17 -0.975,3.625; 18 -1.625,3.625; 19 -2.275,3.625; 20 -2.925,3.625
SOT23-6 = smd 0.55 x 1.2: 1 0.95,-1.3; 2 0,-1.3; 3 -0.95,-1.3; 4 -0.95,1.3; 5 0,1.3; 6 0.95,1.3
SOT23-5L = smd 0.55 x 1.2: 1 -0.95,-1.3; 2 0,-1.3; 3 0.95,-1.3; 4 0.95,1.3; 5 -0.95,1.3
SLOT-1376408-1_1.8V = smd 0.45 x 2.3: 1 2.15,1.4; 3 2.75,1.4; 5 3.35,1.4; 7 3.95,1.4; 9 4.55,1.4; 11 5.15,1.4; 13 5.75,1.4; 15 6.35,1.4; 17 6.95,1.4; 19 7.55,1.4; 21 8.15,1.4; 23 8.75,1.4; 25 9.35,1.4; 27 9.95,1.4; 29 10.55,1.4; 31 11.15,1.4; 33 11.75,1.4; 35 12.35,1.4; 37 12.95,1.4; 39 13.55,1.4; 41 17.75,1.4; 43 18.35,1.4; 45 18.95,1.4; 47 19.55,1.4; 49 20.15,1.4; 51 20.75,1.4; 53 21.35,1.4; 55 21.95,1.4; 57 22.55,1.4; 59 23.15,1.4; 61 23.75,1.4; 63 24.35,1.4; 65 24.95,1.4; 67 25.55,1.4; 69 26.15,1.4; 71 26.75,1.4; 73 27.35,1.4; 75 27.95,1.4; 77 28.55,1.4; 79 29.15,1.4; 81 29.75,1.4; 83 30.35,1.4; 85 30.95,1.4; 87 31.55,1.4; 89 32.15,1.4; 91 32.75,1.4; 93 33.35,1.4; 95 33.95,1.4; 97 34.55,1.4; 99 35.15,1.4; 101 35.75,1.4; 103 36.35,1.4; 105 36.95,1.4; 107 37.55,1.4; 109 38.15,1.4; 111 38.75,1.4; 113 39.35,1.4; 115 39.95,1.4; 117 40.55,1.4; 119 41.15,1.4; 121 41.75,1.4; 123 42.35,1.4; 125 42.95,1.4; 127 43.55,1.4; 129 44.15,1.4; 131 44.75,1.4; 133 45.35,1.4; 135 45.95,1.4; 137 46.55,1.4; 139 47.15,1.4; 141 47.75,1.4; 143 48.35,1.4; 145 48.95,1.4; 147 49.55,1.4; 149 50.15,1.4; 151 50.75,1.4; 153 51.35,1.4; 155 51.95,1.4; 157 52.55,1.4; 159 53.15,1.4; 161 53.75,1.4; 163 54.35,1.4; 165 54.95,1.4; 167 55.55,1.4; 169 56.15,1.4; 171 56.75,1.4; 173 57.35,1.4; 175 57.95,1.4; 177 58.55,1.4; 179 59.15,1.4; 181 59.75,1.4; 183 60.35,1.4; 185 60.95,1.4; 187 61.55,1.4; 189 62.15,1.4; 191 62.75,1.4; 193 63.35,1.4; 195 63.95,1.4; 197 64.55,1.4; 199 65.15,1.4 | smd 0.45 x 2.3 bottom: 2 2.15,1.4; 4 2.75,1.4; 6 3.35,1.4; 8 3.95,1.4; 10 4.55,1.4; 12 5.15,1.4; 14 5.75,1.4; 16 6.35,1.4; 18 6.95,1.4; 20 7.55,1.4; 22 8.15,1.4; 24 8.75,1.4; 26 9.35,1.4; 28 9.95,1.4; 30 10.55,1.4; 32 11.15,1.4; 34 11.75,1.4; 36 12.35,1.4; 38 12.95,1.4; 40 13.55,1.4; 42 17.75,1.4; 44 18.35,1.4; 46 18.95,1.4; 48 19.55,1.4; 50 20.15,1.4; 52 20.75,1.4; 54 21.35,1.4; 56 21.95,1.4; 58 22.55,1.4; 60 23.15,1.4; 62 23.75,1.4; 64 24.35,1.4; 66 24.95,1.4; 68 25.55,1.4; 70 26.15,1.4; 72 26.75,1.4; 74 27.35,1.4; 76 27.95,1.4; 78 28.55,1.4; 80 29.15,1.4; 82 29.75,1.4; 84 30.35,1.4; 86 30.95,1.4; 88 31.55,1.4; 90 32.15,1.4; 92 32.75,1.4; 94 33.35,1.4; 96 33.95,1.4; 98 34.55,1.4; 100 35.15,1.4; 102 35.75,1.4; 104 36.35,1.4; 106 36.95,1.4; 108 37.55,1.4; 110 38.15,1.4; 112 38.75,1.4; 114 39.35,1.4; 116 39.95,1.4; 118 40.55,1.4; 120 41.15,1.4; 122 41.75,1.4; 124 42.35,1.4; 126 42.95,1.4; 128 43.55,1.4; 130 44.15,1.4; 132 44.75,1.4; 134 45.35,1.4; 136 45.95,1.4; 138 46.55,1.4; 140 47.15,1.4; 142 47.75,1.4; 144 48.35,1.4; 146 48.95,1.4; 148 49.55,1.4; 150 50.15,1.4; 152 50.75,1.4; 154 51.35,1.4; 156 51.95,1.4; 158 52.55,1.4; 160 53.15,1.4; 162 53.75,1.4; 164 54.35,1.4; 166 54.95,1.4; 168 55.55,1.4; 170 56.15,1.4; 172 56.75,1.4; 174 57.35,1.4; 176 57.95,1.4; 178 58.55,1.4; 180 59.15,1.4; 182 59.75,1.4; 184 60.35,1.4; 186 60.95,1.4; 188 61.55,1.4; 190 62.15,1.4; 192 62.75,1.4; 194 63.35,1.4; 196 63.95,1.4; 198 64.55,1.4; 200 65.15,1.4 | hole 1.8: 2.15,6; 65.75,6 | hole 3.5: 33.02,35.56

### Placement (x,y rotation side)
BPR  31.45,4.93 180 top
C1  51.56,25.35 180 bottom
C2  47.65,18.39 0 bottom
C3  18.64,23.88 0 top
C4  9.75,20.29 180 top
C5  4.34,15.42 270 top
C6  7.98,10.11 90 bottom
C7  4.98,24.03 0 top
C8  25.4,23.8 0 top
C10  26.16,17.04 90 bottom
C12  33.15,10.49 90 top
C13  46.71,25.17 180 bottom
C14  4.44,12.14 270 top
C15  19.61,15.16 90 top
C16  48.74,15.16 270 bottom
C17  38.33,15.16 0 top
C18  26.09,15.9 90 top
C19  36.93,10.67 0 bottom
C20  9.53,10.59 90 top
C23  3.94,10.44 270 bottom
C24  11.05,22.38 90 bottom
C25  8.79,23.98 180 top
C26  19.38,16.48 270 bottom
C27  6.3,19.58 180 top
C28  17.91,10.67 270 bottom
C29  54.66,7.09 270 bottom
CLK  35.51,12.6 180 top
CS  27.25,4.93 0 top
CST  18.59,21.97 0 top
JP1  32.51,29.69 0 top
JP2  21.49,12.8 180 top
JP11  51.71,36.37 180 top
JP21  43.69,35.86 0 top
LED1  44.07,10.59 180 top
LED4  15.65,15.19 180 top
LED5  10.34,5.36 270 top
LED6  8.41,22.33 270 top
LED7  12.29,10.92 90 top
LED8  18.34,23.14 270 bottom
LED9  23.44,12.73 0 top
PCG  25.35,21.92 180 top
POT2  5.51,27.05 90 top
POT3  18.77,27.05 90 top
POT4  25.93,27.05 90 top
POT5  12.19,27.05 90 top
Q3  14.73,11.76 90 bottom
R1  15.24,10.92 0 top
R2  11.56,8.66 0 bottom
R4  33.86,26.49 180 bottom
R5  11.84,11.89 270 bottom
R6  12.47,18.64 0 top
R7  13.94,15.29 90 top
R9  19.66,7.49 270 top
R10  21.69,7.49 90 top
R13  31.6,11 90 top
R14  26.75,11.1 90 top
R17  58.29,10.03 0 bottom
R18  61.44,10.06 0 bottom
R20  44.07,13.67 90 top
R21  15.82,9.17 90 bottom
R22  35.08,23.29 0 bottom
R24  13.31,15.93 0 bottom
R25  16.26,24.51 270 bottom
R26  21.18,22.33 270 bottom
R27  23.44,9.22 270 top
R29  39.22,6.35 0 top
R30  39.9,11.79 90 top
R31  39.95,8.69 90 top
R32  34.87,8.69 90 top
R33  35.81,6.3 180 top
R36  14.66,18.64 270 bottom
R37  22.86,22.38 270 bottom
R39  61.95,27.1 270 bottom
R40  59.92,27.1 270 bottom
R41  52.15,13.56 0 bottom
R48  14.73,17.45 180 top
R49  7.39,5.36 180 top
R50  5.56,22.33 180 top
R51  15.24,9.25 180 top
R52  12.07,9.25 180 top
RST  12.22,23.98 180 top
RX1  59.18,30.18 90 top
SJ1  43.71,22.05 270 bottom
TX1  59.16,28.78 90 top
U1  50.09,21.82 270 top
U2  32.59,18.16 180 top
U3  32.36,18.21 180 bottom
U4  37.36,9.14 90 top
U5  29.16,11.4 0 top
U6  29.21,7.42 0 top
U7  52.07,17.91 180 bottom
U8  11.53,15.82 0 top
U9  7.04,12.7 0 top
U10  60.2,11.46 0 top
U11  13.84,22.43 0 bottom
U12  18.06,20.9 90 bottom
U13  20.98,11.48 0 top
U14  54.69,6.76 0 top
U15  47.19,22.56 270 bottom
U16  7.06,9.7 0 top
U17  7.29,17.17 90 top
U$1  32.51,27.69 180 top
U$2  8.76,22.76 90 bottom
U$3  19.74,19.08 90 top
X1  0,0 0 top

### Tracks (layer width: path | path; a pad name or v marks a point on that pad's centre or on a via)
+5V  (via drill 0.5, 0.6)  (1 unrouted)
  Top 0.254: U10.20 57.27,13.79 v56.9,13.41 57.33,12.98 v61.26,12.98 | v54.64,9.5 54.64,8.11 U14.5 54.69,7.96 C29.1 | 7.01,9.55 7.06,9.5 9.52,9.5 C20.1 | 5.11,9.55 4.85,9.3 | U17.2 8.64,17.12 U8.5 10.58,20.27 C4.1 10.68,20.37 13.08,20.37 13.32,20.13 R6.2 | 6.78,12.5 6.78,13.23 7.01,13.46 7.75,13.46 8.05,13.84 8.05,15.01 7.47,15.75 7.47,16.99 7.65,17.17 U17.2 | v19.18,12.8 19.15,12.78 U13.5 19.99,12.82 19.99,13.87 19.61,14.25 C15.1 | U1.7 49.29,25.54 v49.07,25.32 | U1.28 50.09,18.14 v49.91,18.31 | U17.2 8.56,17.14 7.54,17.14 4.83,17.14 4.34,16.66 C5.1 | U9.1 5.77,12.47 5.23,13 4.46,13 C14.1 | U6.8 32.88,8.39 33.15,8.66 C12.1 33.2,9.61 33.65,9.61 | v15.57,27.03 15.57,28.63 15.54,28.65 | X1.12 5.15,3.09 5.16,3.1 | 33.65,9.61 33.96,9.61 34.8,9.61 R32.2 34.99,9.42 37.08,9.42 37.36,9.7 U4.5 37.36,11.1 37.8,11.53 38.35,11.53 v38.66,11.84 38.66,12.67 | 38.66,12.67 39.92,12.67 R30.2 | 26.16,14.97 26.16,13.56 26.57,13.16 28.14,13.16 28.21,13.09 U5.5 29.05,12.7 29.18,12.57 29.18,11.53 v29.26,11.46 | 26.16,14.97 C18.1 | v33.58,7.72 33.58,9.61 33.65,9.61 | 26.16,14.97 26.16,15.09 26.09,15.16 | 38.66,12.67 38.66,13.39 38.23,13.82 35.97,13.82 35.76,14.02 U2.14 C17.1 37.48,15.84 37.8,16.15 40.39,16.15 41.06,16.83
  Top 0.305: U16.2 7.06,9.5 7.06,12.22 6.78,12.5 6.11,12.5 U9.1 | C27.1 7.15,17.54 7.54,17.14
  Top 0.406: 7.01,9.55 5.11,9.55 | POT2.1 7.29,28.24 7.7,28.65 13.69,28.65 | 13.69,28.65 15.54,28.65 20.17,28.65 | 20.17,28.65 26.97,28.65 POT4.1 28.47,28.24 30.38,26.34 34.04,26.34 34.18,26.48 | POT3.1 20.22,28.6 20.17,28.65 | POT5.1 13.64,28.6 13.69,28.65 | 34.18,26.48 35.05,27.36 JP1.2 | 34.18,26.48 34.24,26.42 34.24,25.45 34.72,24.97 38.61,24.97 39.83,23.75 39.83,18.06 41.06,16.83 41.96,15.93 41.96,4.77 41.88,4.44 v41.78,4.39 | JP21.2 48.54,35.86 JP11.2 49.05,31.62 v47.73,30.3 | R6.2 16.36,18.64 16.97,18.03 v16.97,17.53
  Bottom 0.254: v56.9,13.41 54.99,13.41 54.71,13.13 54.71,9.58 v54.64,9.5 54.66,9.47 C29.1 | X1.10 4.55,4.19 v4.57,4.22 4.52,4.27 4.52,5.11 12.34,5.11 13.06,5.82 17.17,5.82 19.15,7.57 19.18,12.67 | X1.12 5.15,3.59 5.13,3.61 5.13,3.28 | 5.13,3.28 5.13,1.42 X1.12 | X1.12 5.15,3.5 5.16,3.5 5.16,3.25 | 5.16,3.17 X1.12 | C2.1 48.58,18.31 v49.91,18.31 50.09,18.14 U1.28 | U1.28 50.13,15.98 U7.8 50.08,15.98 50.01,16.05 50.01,18.11 49.86,18.26 49.86,21.41 50.55,22.1 50.55,25.18 C1.1 50.92,25.32 v49.07,25.32 49.17,25.43 49.17,28.19 49.23,28.24 50.62,28.24 | C16.1 U1.28 | U12.5 U12.1 | R39.2 R40.2 58.76,26.25 58.67,26.16 | v61.26,12.98 60.81,13.44 60.81,18.16 58.67,20.29 58.67,26.16 | 58.67,29.51 58.67,26.16 | U15.5 45.89,25.14 C13.1 45.86,28.05 46.05,28.24 | U11.2 13.84,26.49 14.17,26.82 15.37,26.82 v15.57,27.03 | R4.2 34.82,26.49 35.37,27.04 | X1.12 5.15,3.17 5.16,3.17 | 5.16,3.17 5.16,3.25 | 5.16,3.25 5.13,3.28 | v33.58,7.72 33.5,7.87 33.5,10.85 32.89,11.46 v29.26,11.46 28.55,11.46 27.91,12.09 U3.16 27.9,15.39 26.57,15.39 26.16,15.8 C10.1
  Bottom 0.305: v38.66,11.84 38.66,10.95 38.35,10.64 37.86,10.64 C19.1 | C28.1 17.91,12.39 18.26,12.75 19.05,12.75 v19.18,12.8
  Bottom 0.406: 4.67,4.27 14.76,4.27 15.16,4.67 17.2,4.67 17.7,4.42 v41.78,4.39 | v47.73,30.3 47.73,28.3 47.78,28.24 | R24.1 14.71,17.55 14.91,17.75 | 14.91,17.75 14.69,17.75 R36.2 | 16.76,17.73 16.71,17.78 14.94,17.78 14.91,17.75 | U12.1 16.76,17.73 | C26.1 17.16,17.33 v16.97,17.53 16.76,17.73
  Bottom 0.61: v4.57,4.22 4.47,4.32 4.47,7.39 3.94,7.92 C23.A 3.91,9.07 | JP1.2 35.05,27.36 35.37,27.04 35.99,26.42 43.92,26.42 45.75,28.24 46.05,28.24 47.78,28.24 50.62,28.24 52.78,30.4 57.78,30.4 58.67,29.51
  pour Top: 3.89,0.94 3.89,10.08 5.26,10.08 5.26,0.94
  pour Bottom: 3.81,1.24 3.81,4.8 5.31,4.8 5.31,1.24
AMD
  Top 0.254: X1.187 61.55,5.56 61.19,5.92 61.19,7.81 U10.7
AMD_O
  Top 0.254: U10.14 61.17,20.34 58.06,23.44 55.91,23.44 U1.41
AUX_O
  Top 0.254: U14.4 53.74,14.03 53.29,14.48 U1.32
BOTS
  Top 0.254: X1.189 62.15,5.72 61.82,6.04 U10.8
BOTS_O
  Top 0.254: U10.13 61.82,20.47 58.17,24.18 55.93,24.18 U1.42
BPD
  Top 0.254: X1.177 58.55,4.52 57.94,5.13 57.94,7.82 U10.2
BPD-R-SET  (via drill 0.5)
  Top 0.178: X1.49 20.15,4.91 v20.57,5.33 | v29.08,18.74 29.13,18.74 29.41,19.02 U2.6 | U2.6 29.41,21.08 29.46,21.13 29.46,20.89 U2.6
  Bottom 0.178: v20.57,5.33 20.57,11.02 21.11,11.56 21.11,18.29 21.54,18.72 23.14,18.72 23.85,19.43 23.85,21.21 24.13,21.49 25.83,21.49 26.26,21.06 26.26,19.79 26.67,19.38 28.45,19.38 v29.08,18.74
BPD_O
  Top 0.254: U10.19 57.92,18.71 57.25,19.38 55.93,19.38 U1.36
BRAKE_PRESURE
  Top 0.178: X1.69 26.15,3.47 26.67,3.99 30.28,3.99 30.61,4.32 30.61,4.92 BPR.2
  Top 0.254: BPR.2 BPR.1 32.13,5.09 U6.5
CURRENT_SENSOR  (via drill 0.5, 0.6)
  Top 0.178: X1.67 25.55,4.49 25.98,4.93 CS.1
  Top 0.254: CS.1 CS.2 28.02,5.02 28.02,6.86 27.78,7.09 U6.3 24.92,7.09 24.71,6.88 24.71,6.12 v24.64,6.25 | v28.02,23.37 37.44,23.37 38.51,22.3 38.51,17.5 v38.23,17.22
  Bottom 0.254: v24.64,6.25 24.74,6.12 39.5,6.12 40.08,6.58 40.11,14.96 38.23,16.84 v38.23,17.22 | JP21.1 43.56,33.32 43,32.77 29.77,32.77 28.65,31.65 28.65,24 v28.02,23.37
ECU
  Top 0.254: X1.191 62.75,6.06 62.46,6.35 62.46,7.82 U10.9
ECU_O
  Top 0.254: U10.12 62.47,20.76 58.19,25.04 55.91,25.04 U1.43
GND  (via drill 0.5, 0.6)  (1 unrouted)
  Bottom 0.406: LED8.C 17.59,21.91 17.58,21.89 16.64,21.89 16.61,21.87 16.61,21.89 16.59,21.92 | 16.59,21.92 16.46,21.92 | 16.59,21.92 16.69,21.92 U12.3
  other vias: 56.54,16.41 0.94,30.78 63.83,4.5 54.61,14.38 14.68,1.83 66.78,30.91 52.35,23.39 48.16,20.32 54.86,3.51 30.05,8.71 11.71,3.33 22.48,15.9 28.07,17.83 23.01,19.96 22.45,26.95 9.07,27 49.71,24.18 2.26,9.63 34.59,10.97 38.73,9.17 23.7,3.4 16.41,13.33
  pour Top (rank 6): -0.86,-0.03 -1.27,39.07 69.06,38.96 69.01,0.05
  pour Bottom (rank 5): 0.25,-1.37 0.03,39.37 67.44,39.34 67.51,-0.97
IMD
  Top 0.254: X1.179 59.15,4.73 58.6,5.28 58.6,7.81 U10.3
IMD-R-SET  (via drill 0.5)
  Top 0.178: 21.77,13.06 21.93,12.89 U13.4 22.07,12.92 v22.07,14.45 | X1.51 20.75,3.68 21.67,4.6 21.67,5.26 v21.69,5.28
  Top 0.254: U13.4 JP2.1
  Bottom 0.178: v21.69,5.28 21.69,9.65 22.22,10.19 22.76,10.19 23.06,10.49 23.06,14.27 22.96,14.38 22.15,14.38 v22.07,14.45
IMD-SIG
  Top 0.178: R9.2 19.66,1.51 X1.47
IMD_O
  Top 0.254: U10.18 58.57,18.9 57.25,20.22 U1.37 | U1.37
IMD_STAT  (via drill 0.5)
  Top 0.254: R9.1 21.13,8.34 | 21.13,8.34 R10.2 23.42,8.34 R27.2 23.52,8.52 v23.52,7.06 | JP2.2 20.98,12.74 U13.2 20.98,8.5 21.13,8.34 | U1.31 52.49,14.39 53.11,13.77 53.11,9.42 52.25,8.56 v52.25,5.31
  Bottom 0.254: v52.25,5.31 24.21,5.31 23.55,5.92 v23.52,7.06
IS_O  (via drill 0.5)
  Top 0.254: v51.69,17.91 U1.30 | U1.30
  Bottom 0.254: R18.2 60.52,10.03 R17.1 59.19,11.24 58.93,11.51 58.93,16.81 58.37,17.37 52.22,17.37 v51.69,17.91
MAIN
  Top 0.178: X1.43 18.35,6.84 18.75,7.24 18.75,11.96 18.64,12.06 18.64,12.09 17.25,13.49 17.25,14.76 16.76,15.24 15.04,15.24 14.86,15.42 14.86,15.95 14.67,16.14 R7.2
  Top 0.305: U8.4 12.8,17.45 R48.2 13.94,17.39 R7.2
N$1
  Bottom 0.254: 48.54,23.6 48.49,23.55 U15.1 48.48,23.52 47.37,23.52 47.19,23.34 47.19,22.86 46.83,22.5 SJ1.1
N$2  (via drill 0.5)
  Top 0.254: X1.175 57.95,4.15 56.92,5.18 56.92,5.69 v56.87,5.74
  Bottom 0.254: v56.87,5.74 56.87,9.6 57.25,9.98 57.34,9.98 R17.2
N$3
  Top 0.305: POT2.2 4.08,27.04 C7.1 4.08,23.84 3.76,23.52 3.76,18.67 4.32,18.11 5.98,18.11 U17.4
N$4  (via drill 0.6)
  Top 0.254: RST.1 RST.2 11.3,23.98 10.82,24.46 | 10.82,24.46 v10.82,25.48 10.82,26.97 POT5.2 10.63,26.93 | C25.1 10.34,23.98 10.82,24.46
  Bottom 0.254: U11.4 12.89,25.44 12.52,25.81 11.28,25.81 v10.82,25.48
N$5
  Bottom 0.406: R21.2 15.08,10.02 14.43,10.67 13.77,10.67 Q3.1
N$6
  Bottom 0.406: R5.1 13.78,12.74 13.87,12.65 13.87,12.7 13.77,12.8 13.72,12.8 Q3.2
N$7  (via drill 0.5)
  Top 0.254: v30.15,16.87 30.15,19.35 30.68,19.99 U2.5
  Bottom 0.254: v30.15,16.87 35.2,16.87 35.51,16.56 U3.10
N$10
  Top 0.406: U4.4 40.03,10.44 R30.1 40,10.91 R31.2
N$11
  Top 0.254: U16.4 8.01,12.44 U9.2
N$13  (via drill 0.5)
  Top 0.254: v35.71,19.02 35.43,19.02 35.05,18.64 35.05,16.61 35.13,16.54 35.13,13.79 34.9,13.56 30.97,13.56 U5.4
  Bottom 0.254: U3.7 35.53,19.2 v35.71,19.02
N$14
  Bottom 0.254: U3.6 34.23,21.05 R22.2 30.33,23.29 29.36,24.26 29.36,31.42 30,32.05 50.62,32.05 52.17,33.6 52.17,36.04 JP11.1
N$15
  Bottom 0.406: C24.1 9.65,20.98 8.76,21.49 U$2.1 8.67,22 8.66,22 8.76,22.1 U$2.2 | C24.1 11.05,18.47 11.96,17.55 11.96,15.98 R24.2 | U11.3 11.43,21.13 11.18,21.39 11.08,21.39 C24.1
N$16
  Top 0.406: LED1.A R20.1
N$17  (via drill 0.5)
  Top 0.254: 35.84,20.75 35.76,20.83 U2.1 35.83,20.78 36.78,20.78 37.34,20.22 v37.34,18.47
  Bottom 0.254: U3.5 32.99,20.19 33.71,19.48 33.71,18.34 33.93,18.11 36.98,18.11 v37.34,18.47
N$18  (via drill 0.5)
  Top 0.254: U2.2 34.49,19.51 33.96,18.97 v32.79,18.97
  Bottom 0.254: v32.79,18.97 32.36,18.97 31.72,19.96 U3.4
N$19  (via drill 0.5)
  Top 0.254: U2.4 31.95,19.79 v31.11,19.08
  Bottom 0.254: v31.11,19.08 30.78,19.08 30.43,19.51 30.43,20.99 U3.3
N$20  (via drill 0.6)
  Top 0.254: U1.22 43.09,17.82 v42.44,18.47 | v46.2,13.97 46.18,13.97 45.64,14.5 44.08,14.5 R20.2
  Bottom 0.254: v42.44,18.47 42.44,14.6 42.72,14.33 45.85,14.33 v46.2,13.97
N$21
  Top 0.406: U4.3 38.37,7.84 R29.1
N$22  (via drill 0.5)
  Top 0.254: U4.6 36.41,12.57 CLK.1 | CLK.1 CLK.2 | v37.62,12.5 36.49,12.5 CLK.1
  Bottom 0.254: U3.9 36.8,12.83 37.19,12.45 37.57,12.45 v37.62,12.5
N$23  (via drill 0.5)
  Top 0.254: U6.6 30.33,7.09 v29.21,7.09 | PCG.2 PCG.1 24.66,21.92 24.51,21.77 24.51,20.6 v24.69,20.42
  Top 0.305: PCG.2 C8.1 24.5,27.04 POT4.2
  Bottom 0.254: v24.69,20.42 24.69,8.13 25.73,7.09 v29.21,7.09
N$24
  Bottom 0.406: R36.1 14.81,19.65 14.81,19.66 14.79,19.67 U11.1 15.02,20.9 15.42,20.9 | U12.2 15.42,20.9 | R25.2 16.26,23.16 16.18,23.06 15.85,22.76 15.44,22.35 15.44,20.93 15.42,20.9
N$25
  Top 0.406: U4.1 34.67,7.84 R32.1 34.85,6.22 R33.2
N$26
  Top 0.254: CST.1 CST.2 18.62,21.97 18.59,21.95 18.59,17.53 19,17.12 23.49,17.12 24.54,16.08 24.54,8.41 25.2,7.75 U6.2
  Top 0.305: CST.1 C3.1 17.74,26.63 POT3.2
N$28
  Top 0.178: U6.1 27.82,8.39 28.24,8.81 28.24,10.07 U5.1 28.06,10.25 R14.1
N$29
  Bottom 0.254: R26.1 19.13,23.18 LED8.A
N$30
  Top 0.178: U6.7 31.27,7.75 31.01,7.9 30.81,7.87 29.64,7.87 29.16,8.33 U5.2
  Top 0.254: R13.1 31.6,9.83 30.96,9.19 30.96,7.87 30.81,7.87
N$32
  Top 0.254: R27.1 LED9.A
N$33
  Top 0.305: LED7.A R1.1
N$39  (via drill 0.5)
  Top 0.254: TX1.A 60.55,28.78 60.83,29.06 61.01,29.31 v61.04,29.34
  Bottom 0.254: v61.04,29.34 59.74,29.34 59.56,29.13 59.56,28.15 R40.1
N$40
  Top 0.178: U1.17 43.21,21.82 42.62,22.4 42.62,26.72 42.21,27.13 40.49,27.13 40.18,27.43 40.18,29.39 JP1.4
N$41  (via drill 0.5)
  Top 0.254: v61.37,30.66 60.41,30.66 RX1.A
  Bottom 0.254: R39.1 61.95,29.92 v61.37,30.66
N$43
  Top 0.178: U1.16 43.32,22.62 43.08,22.86 43.08,29.29 JP1.5
N$46  (via drill 0.5)
  Top 0.254: v42.24,21.06 44.25,21.06 U1.18
  Bottom 0.254: JP1.1 32.54,29.67 32.54,27.76 33.01,27.29 R4.1 33.01,25.79 33.25,25.55 41.78,25.55 42.09,25.25 42.09,21.21 v42.24,21.06 43.36,21.06 43.71,21.41 SJ1.2
N$59  (via drill 0.5)
  Top 0.254: U17.3 8.93,18.12 9.14,18.34 9.14,18.36 v9.52,18.74
  Bottom 0.254: v9.52,18.74 9.52,16.74 10.29,15.98 10.29,11.33 10.59,11.02 | 10.59,11.02 11.82,11.02 R5.2 | R2.2 10.16,8.79 | 10.16,8.79 10.16,10.59 10.59,11.02 | C6.1 10.08,8.71 10.16,8.79
N$62  (via drill 0.6)
  Top 0.254: U17.1 8.61,16.2 8.61,15.44 9.17,14.88 v9.19,14.88 10.03,15.72 11.38,15.72 | U8.2 11.53,15.57 11.38,15.72 | R6.1 11.62,15.96 11.38,15.72
  Top 0.305: R50.2 4.71,21.14 v4.85,21.01
  Bottom 0.254: v4.85,21.01 4.85,15.7 5.31,15.24 8.84,15.24 v9.19,14.88
N$63
  Top 0.305: LED4.A 15.65,17.39 R48.1
N$65
  Top 0.406: LED5.A R49.1
N$67
  Top 0.305: LED6.A R50.1
RELAY-SET  (via drill 0.5, 0.6)
  Top 0.178: U$3.1 23.41,18.23 v23.75,17.88 | v22.86,5.28 22.83,4.67 21.36,3.2 X1.53
  Top 0.254: U$3.1 U$3.2
  Top 0.406: v21.62,19.74 21.56,19.74 21.18,20.12 19.93,20.12 U$3.2
  Bottom 0.178: v23.75,17.88 23.75,9.09 22.61,7.95 22.61,5.54 v22.86,5.28
  Bottom 0.254: R37.2 21.23,21.53 R26.2 20.38,21.48 20.02,21.84 19.37,21.84 U12.4
  Bottom 0.406: 20.38,21.48 21.22,21.48 21.26,21.44 21.26,20.09 v21.62,19.74
RS-A  (via drill 0.5)
  Top 0.178: X1.85 30.95,2.96 31.22,3.23 49.25,3.23 50.22,4.19 50.22,10.82 50.57,11.18 51.99,11.18 v52.2,10.97
  Bottom 0.178: v52.2,10.97 52.58,10.97 53.01,11.4 53.01,13.55 R41.1
  Bottom 0.254: U7.6 52.39,14.79 52.96,14.22 52.96,13.6 R41.1
RS-B  (via drill 0.5)
  Top 0.178: X1.87 31.55,2.72 31.7,2.87 49.38,2.87 50.55,4.04 50.55,9.85 50.85,10.16 v51.03,10.16
  Bottom 0.178: R41.2 51.3,10.43 v51.03,10.16
  Bottom 0.254: U7.7 51.74,14.74 51.33,14.33 51.33,13.6 R41.2
RTG
  Top 0.178: X1.39 13.55,4.56 14.45,5.46 15.44,5.46 15.93,5.94 15.93,9.08 R51.1
  Top 0.254: 16.33,9.16 R51.1
  Top 0.305: R1.2 R51.1
RTG_5V  (via drill 0.6)
  Top 0.254: U1.23 43.19,16.02 40.82,18.39 40.82,24.41 v40.89,24.49 | v30.2,29.77 3.25,29.77 v1.9,28.42 | v14.48,7.01 14.48,9.16 R51.2
  Top 0.305: 14.67,9.25 R51.2 R52.1 12.85,9.21 12.85,8.25 12.32,7.72 8.41,7.72 8.01,8.12 U16.3
  Bottom 0.254: v40.89,24.49 31.09,24.49 30.3,25.27 30.3,29.67 v30.2,29.77 | v1.9,28.42 1.9,24.66 3.43,23.14 3.43,17.81 2.46,16.84 2.46,10.85 2.79,10.52 4.52,10.52 5.23,9.8 5.23,6.02 5.49,5.77 11.61,5.77 12.37,6.58 12.83,7.04 14.45,7.04 v14.48,7.01
RX1  (via drill 0.5)
  Top 0.254: U1.1 54.53,27.18 v56.03,27.18 56.87,27.18 57.05,27.36 57.05,29.79 57.43,30.17 RX1.C
  Bottom 0.254: U7.1 51.09,20.59 51.43,20.93 54.03,20.93 54.41,21.31 54.41,26.49 54.97,27.05 55.91,27.05 v56.03,27.18
SSW_C
  Top 0.254: X1.181 59.75,5.05 59.23,5.56 59.23,7.82 U10.4
SSW_C_O
  Top 0.254: U10.17 59.22,19.21 57.43,21.01 55.9,21.01 U1.38
SSW_L
  Top 0.254: X1.185 60.95,5.37 60.53,5.79 U10.6
SSW_L_O
  Top 0.254: U10.15 60.52,19.97 57.89,22.61 55.9,22.61 U1.40
SSW_R
  Top 0.254: X1.183 60.35,5.16 59.89,5.61 59.89,7.81 U10.5
SSW_R_O
  Top 0.254: U10.16 59.87,19.43 57.45,21.84 55.91,21.84 U1.39
START  (via drill 0.5)
  Top 0.254: U8.1 10.58,12.84 11,12.42 17.55,12.42 17.81,12.17 17.81,8.36 v17.93,8.23
  Top 0.406: U16.1 6.11,6.92 v6.27,6.76 6.27,5.74 R49.2 | X1.41 17.75,8.05 v17.93,8.23
  Bottom 0.254: R2.1 12.96,8.16 11.38,6.58 6.45,6.58 v6.27,6.76
  Bottom 0.406: R2.1 14.68,8.66 15.01,8.33 15.81,8.33 R21.1 17.84,8.32 v17.93,8.23
TSMS
  Top 0.254: X1.173 57.35,3.46 56.57,4.24 55.83,4.24 55.65,4.42 55.65,5.44 U14.1
TSMS_O
  Top 0.254: U14.6 55.64,16.25 54.41,17.47 54.41,18.41 54.56,18.57 55.84,18.57 U1.35
TX1  (via drill 0.5)
  Top 0.254: U1.44 55.9,25.81 57,25.81 57.58,26.21 v57.61,26.21 58.41,26.76 TX1.C
  Bottom 0.254: U7.4 54.17,19.86 54.91,20.6 54.91,25.96 55.24,26.29 57.53,26.29 v57.61,26.21
U7-RE/DE  (via drill 0.5)
  Top 0.254: v55.7,28.55 54.97,28.55 54.58,28.93 53.44,28.93 53.31,28.8 53.31,27.64 U1.2
  Bottom 0.254: U7.2 U7.3 52.39,20.07 52.35,20.12 52.35,19.91 52.3,19.86 51.82,19.86 51.79,19.84 51.79,19.13 51.61,18.95 50.8,18.95 50.52,19.23 50.52,20.95 51.03,21.46 53.64,21.46 53.9,21.72 53.9,27.36 54.69,28.14 55.3,28.14 v55.7,28.55
WDT  (via drill 0.5)
  Top 0.254: U1.19 46.1,20.22 v46.2,20.12
  Bottom 0.254: v46.2,20.12 46.15,20.12 45.87,20.4 45.87,21.58 U15.4

### Text on the board
tPlace: TRIP | Safety System | "SS" | University of Akron | C-SET | P-SET | R-SET | + | T-SET